# EAGLE design placa (EAGLE 9.5.1)
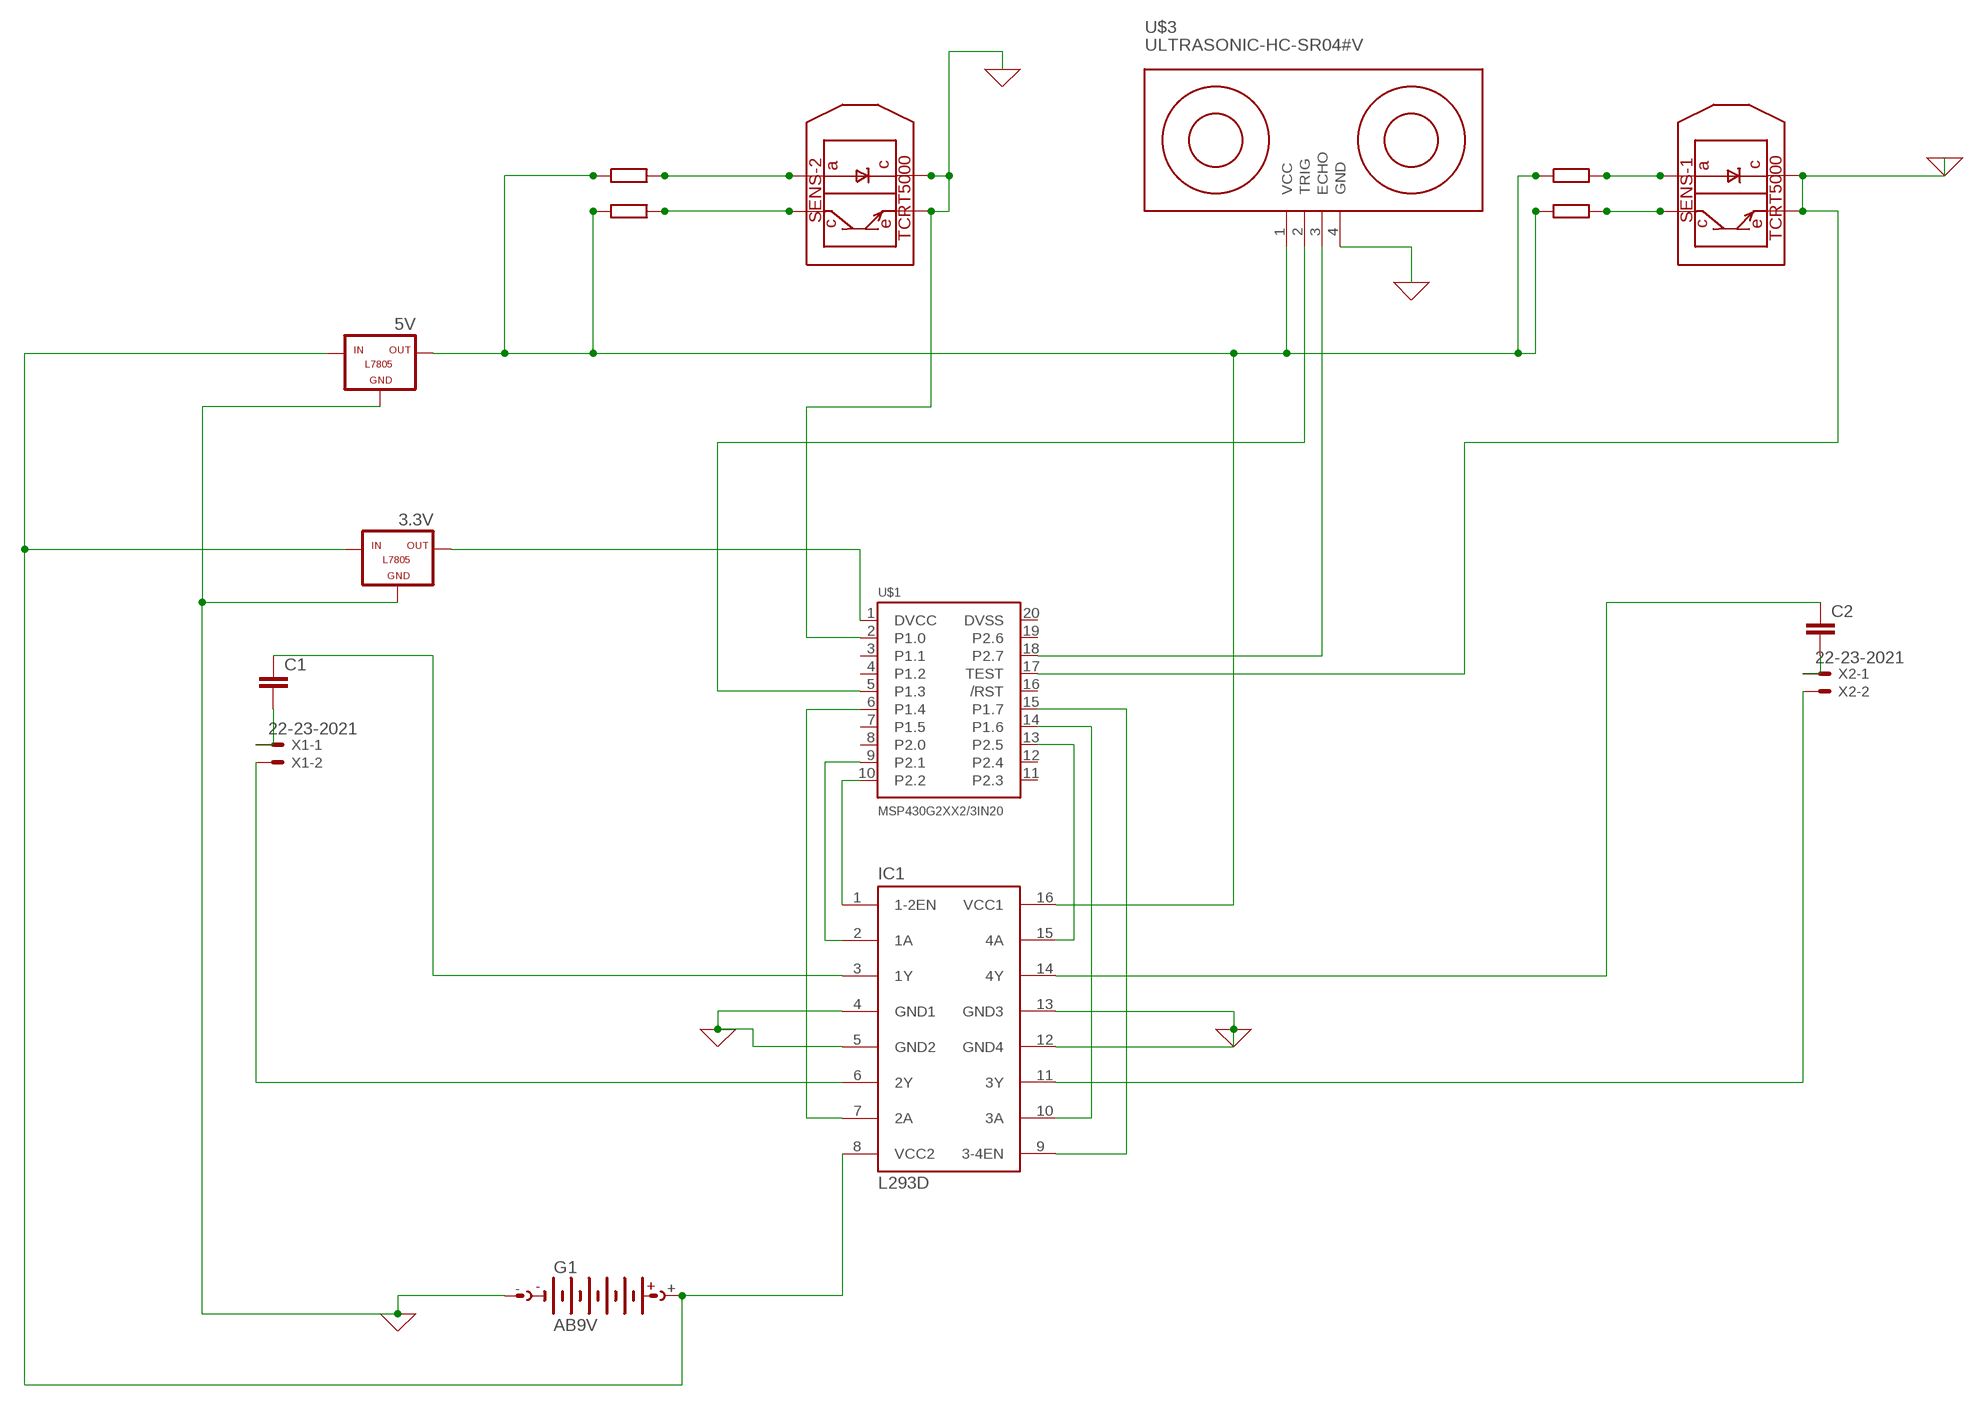
[diagram p0: schematic, sheet 1]

## Parts
3.3V  -L7805  [L7805]
5V  -L7805  [L7805]
C1  C2.5/2  [C2.5-2]
C2  C2.5/2  [C2.5-2]
G1  AB9V  [AB9V]
IC1  L293D  [DIL16]
SENS-1  TCRT5000  [5000]
SENS-2  TCRT5000  [5000]
U$1  MSP430G2XX2/3IN20  [DIL20]
U$3  ULTRASONIC-HC-SR04#V  [ULTRASONIC-HC-SR04#V]
X1  22-23-2021  [22-23-2021]
X2  22-23-2021  [22-23-2021]

## Nets
0: 3.3V.GND 5V.GND G1.- IC1.4(GND1) IC1.5(GND2) IC1.12(GND4) IC1.13(GND3) SENS-1.P$2 SENS-1.P$4 SENS-2.P$2 SENS-2.P$4 U$1.2(P1.0) U$1.17(TEST) U$3.4(GND) ; supply symbol labelled GND
N$1: 3.3V.OUT U$1.1(DVCC)
N$2: SENS-2.P$3
N$3: IC1.1(1-2EN) U$1.10(P2.2)
N$4: IC1.2(1A) U$1.9(P2.1)
N$5: IC1.7(2A) U$1.6(P1.4)
N$6: C1.1 IC1.3(1Y)
N$7: C1.2 X1.1
N$8: IC1.15(4A) U$1.13(P2.5)
N$9: IC1.10(3A) U$1.14(P1.6)
N$10: IC1.9(3-4EN) U$1.15(P1.7)
N$11: IC1.11(3Y) X2.2
N$13: IC1.6(2Y) X1.2
N$14: C2.2 X2.1
N$15: C2.1 IC1.14(4Y)
N$16: 5V.OUT IC1.16(VCC1) U$3.1(VCC)
N$17: SENS-2.P$1
N$18: 3.3V.IN 5V.IN G1.+ IC1.8(VCC2)
N$19: SENS-1.P$3
N$20: SENS-1.P$1
N$22: U$1.5(P1.3) U$3.2(TRIG)
N$23: U$1.18(P2.7) U$3.3(ECHO)
Unconnected: U$1.3(P1.1) U$1.4(P1.2) U$1.7(P1.5) U$1.8(P2.0) U$1.11(P2.3) U$1.12(P2.4) U$1.16(/RST) U$1.19(P2.6)

## Power pins joined to a net without a drawn wire
DVSS: U$1.20(DVSS)

## Library data of the parts
3.3V 5V = tango:-L7805
C1 C2 = capacitor-wima:C: CAPACITOR naming: grid - package width
G1 = battery:AB9V: 9-V BATTERY CLIP
IC1 = st-microelectronics:L293D: PUSH-PULL 4 CHANNEL DRIVER; MPN: L293D; OC_FARNELL: 9589619; OC_NEWARK: 56P8249
SENS-1 SENS-2 = qfm-trx1-24g:TCRT5000: Reflective Optical Sensor with Transistor Output. Vishay Semiconductors
U$1 = ti_msp430gxxx:MSP430G2XX2/3: Mixed Signal Microcontroller MSP430 Value Line MSP430G2432: 1x EEM, 8 KiB Flash Memory, 256 B RAM, 1x Timer_A, 1x USI, 8x ADC10 Ch, 16x I/O MSP430G2332: 1x EEM, 4 KiB Flash Memory, 256 B RAM, 1x Timer_A, 1x USI, 8x ADC10 Ch, 16x I/O MSP430G2232: 1x EEM, 2 KiB Flash Memory, 256 B RAM, 1x Timer_A, 1x USI, 8x ADC10 Ch, 16x I/O MSP430G2132: 1x EEM, 1 KiB Flash Memory, 128 B RAM, 1x Timer_A, 1x USI, 8x ADC10 Ch, 16x I/O MSP430G2402: 1x EEM, 8 KiB Flash Memory, 256 B RAM, 1x Timer_A, 1x USI, 16x I/O MSP430G2302: 1x EEM, 4 KiB Flash Memory, 256 B RAM, 1x Timer_A, 1x USI, 16x I/O MSP430G2202: 1x EEM, 2 KiB Flash Memory, 256 B RAM, 1x Timer_A, 1x USI, 16x I/O MSP430G2102: 1x EEM, 1 KiB Flash Memory, 128 B RAM, 1x Timer_A, 1x USI, 16x I/O MSP430G2452: 1x EEM, 8 KiB Flash Memory, 256 B RAM, 1x Timer_A, 8x Comp_A Ch, 1x USI, 8x ADC10 Ch, 16x I/O MSP430G2352: 1x EEM, 4 KiB Flash Memory, 256 B RAM, 1x Timer_A, 8x Comp_A Ch, 1x USI, 8x ADC10 Ch, 16x I/O MSP430G2252: 1x EEM, 2 KiB Flash Memory, 256 B RAM, 1x Timer_A, 8x Comp_A Ch, 1x USI, 8x ADC10 Ch, 16x I/O MSP430G2152: 1x EEM, 1 KiB Flash Memory, 128 B RAM, 1x Timer_A, 8x Comp_A Ch, 1x USI, 8x ADC10 Ch, 16x I/O MSP430G2412: 1x EEM, 8 KiB Flash Memory, 256 B RAM, 1x Timer_A, 8x Comp_A Ch, 1x USI, 16x I/O MSP430G2312: 1x EEM, 4 KiB Flash Memory, 256 B RAM, 1x Timer_A, 8x Comp_A Ch, 1x USI, 16x I/O MSP430G2212: 1x EEM, 2 KiB Flash Memory, 256 B RAM, 1x Timer_A, 8x Comp_A Ch, 1x USI, 16x I/O MSP430G2112: 1x EEM, 1 KiB Flash Memory, 128 B RAM, 1x Timer_A, 8x Comp_A Ch, 1x USI, 16x I/O MSP430G2533: 1x BSL, 1x EEM, 16 KiB Flash Memory, 512 B RAM, 2x Timer_A, 8x ADC10 Ch, 1x USCI A0/B0, 16x I/O MSP430G2433: 1x BSL, 1x EEM, 8 KiB Flash Memory, 512 B RAM, 2x Timer_A, 8x ADC10 Ch, 1x USCI A0/B0, 16x I/O MSP430G2333: 1x BSL, 1x EEM, 4 KiB Flash Memory, 256 B RAM, 2x Timer_A, 8x ADC10 Ch, 1x USCI A0/B0, 16x I/O MSP430G2233: 1x BSL, 1x EEM, 2 KiB Flash Memory, 256 B RAM, 2x Timer_A, 8x ADC10 Ch, 1x USCI A0/B0, 16x I/O MSP430G2403: 1x BSL, 1x EEM, 8 KiB Flash Memory, 512 B RAM, 2x Timer_A, 1x USCI A0/B0, 16x I/O MSP430G2303: 1x BSL, 1x EEM, 4 KiB Flash Memory, 256 B RAM, 2x Timer_A, 1x USCI A0/B0, 16x I/O MSP430G2203: 1x BSL, 1x EEM, 2 KiB Flash Memory, 256 B RAM, 2x Timer_A, 1x USCI A0/B0, 16x I/O MSP430G2553: 1x BSL, 1x EEM, 16 KiB Flash Memory, 512 B RAM, 2x Timer_A, 8x Comp_A+ Ch, 8x ADC10 Ch, 1x USCI A0/B0, 16x I/O MSP430G2453: 1x BSL, 1x EEM, 8 KiB Flash Memory, 512 B RAM, 2x Timer_A, 8x Comp_A+ Ch, 8x ADC10 Ch, 1x USCI A0/B0, 16x I/O MSP430G2353: 1x BSL, 1x EEM, 4 KiB Flash Memory, 256 B RAM, 2x Timer_A, 8x Comp_A+ Ch, 8x ADC10 Ch, 1x USCI A0/B0, 16x I/O MSP430G2253: 1x BSL, 1x EEM, 2 KiB Flash Memory, 256 B RAM, 2x Timer_A, 8x Comp_A+ Ch, 8x ADC10 Ch, 1x USCI A0/B0, 16x I/O MSP430G2153: 1x BSL, 1x EEM, 1 KiB Flash Memory, 256 B RAM, 2x Timer_A, 8x Comp_A+ Ch, 8x ADC10 Ch, 1x USCI A0/B0, 16x I/O MSP430G2513: 1x BSL, 1x EEM, 16 KiB Flash Memory, 512 B RAM, 2x Timer_A, 8x Comp_A+ Ch, 1x USCI A0/B0, 16x I/O MSP430G2413: 1x BSL, 1x EEM, 8 KiB Flash Memory, 512 B RAM, 2x Timer_A, 8x Comp_A+ Ch, 1x USCI A0/B0, 16x I/O MSP430G2313: 1x BSL, 1x EEM, 4 KiB Flash Memory, 256 B RAM, 2x Timer_A, 8x Comp_A+ Ch, 1x USCI A0/B0, 16x I/O MSP430G2213: 1x BSL, 1x EEM, 2 KiB Flash Memory, 256 B RAM, 2x Timer_A, 8x Comp_A+ Ch, 1x USCI A0/B0, 16x I/O MSP430G2113: 1x BSL, 1x EEM, 1 KiB Flash Memory, 256 B RAM, 2x Timer_A, 8x Comp_A+ Ch, 1x USCI A0/B0, 16x I/O
U$3 = diy-modules:ULTRASONIC-HC-SR04: Ultrasonic Ranging Module HC-SR04 More details available here: http://randomnerdtutorials.com/complete-guide-for-ultrasonic-sensor-hc-sr04/ Click here to find device on ebay.com <http://www.ebay.com/sch/hc+sr04+ultrasonic>
X1 X2 = con-molex:22-23-2021: .100" (2.54mm) Center Header - 2 Pin; MF: MOLEX; MPN: 22-23-2021; OC_FARNELL: 1462926; OC_NEWARK: 25C3832

## Board
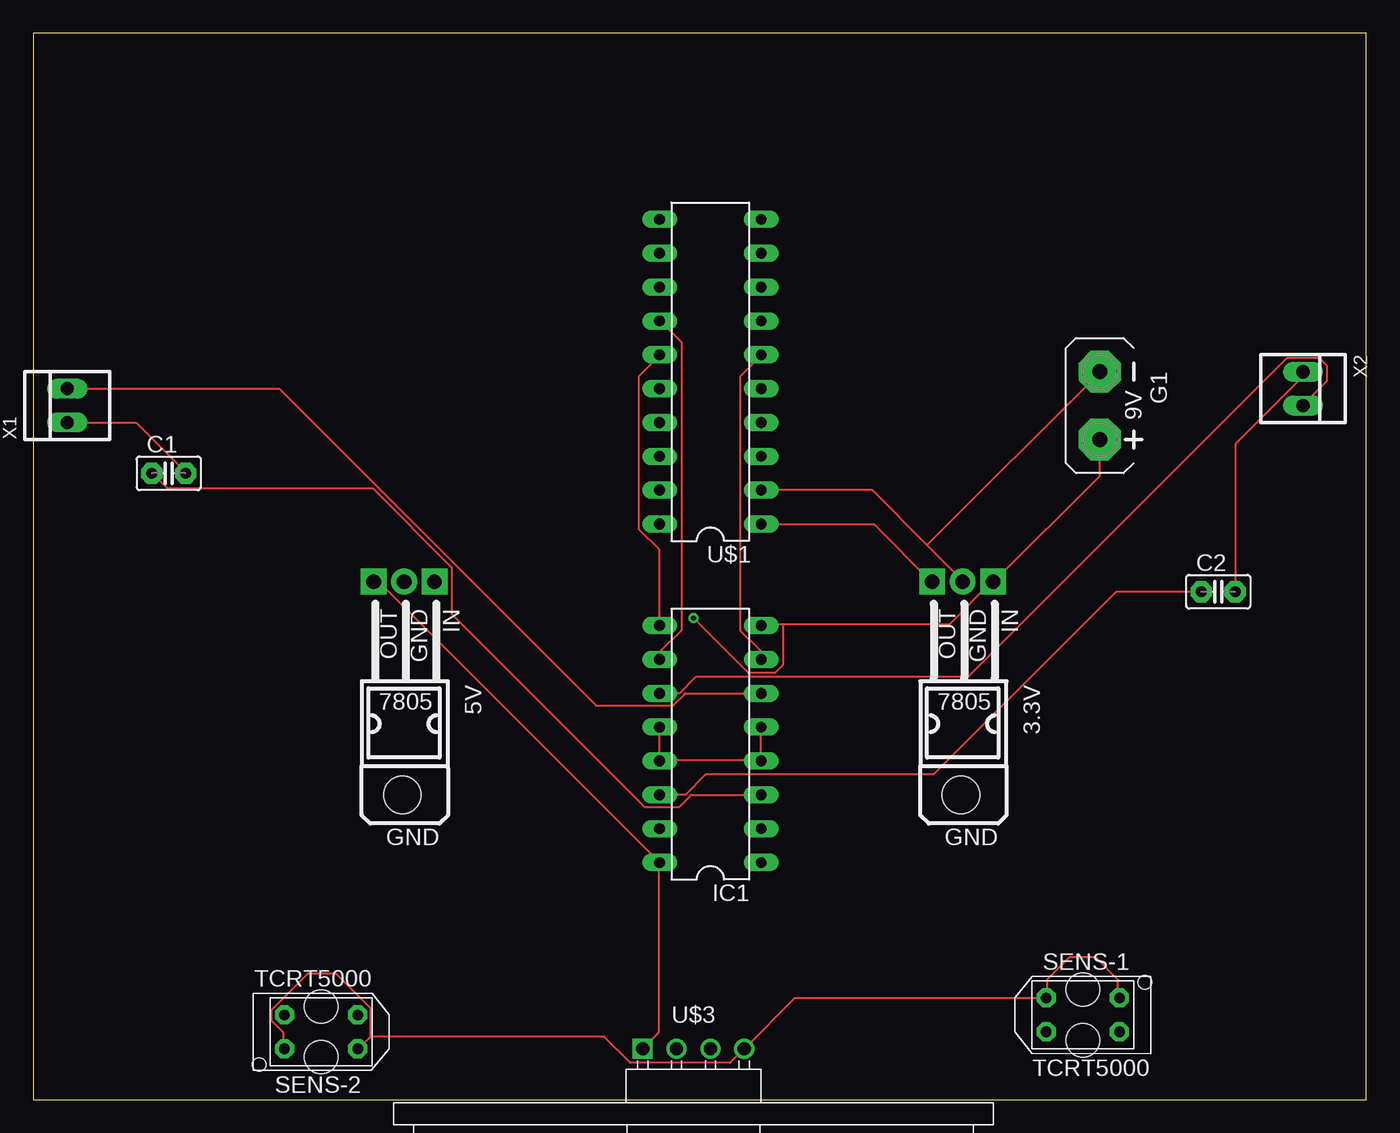
[diagram p1: board, top side]
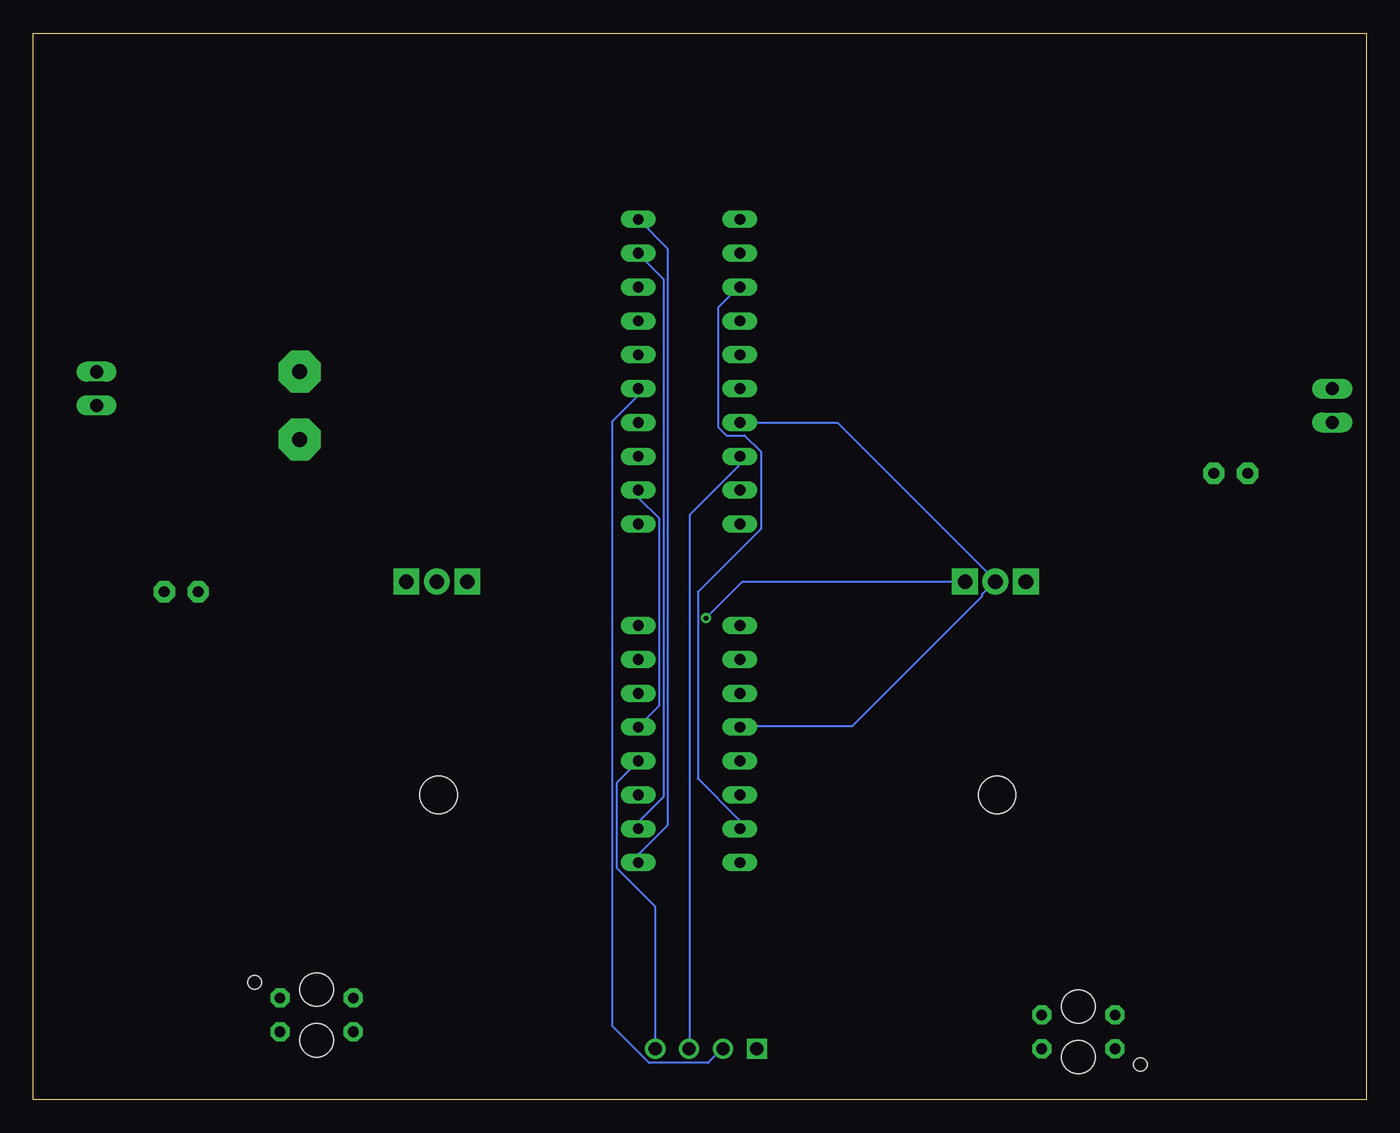
[diagram p2: board, bottom side, seen from below]

Size 100 x 80 mm. Coordinates in mm from the lower left corner, seen from the top.
Outline: 0,0 100,0 100,80 0,80 0,0
Copper layers (1*16): Top 0.035mm / dielectric 1.5mm / Bottom 0.035mm
Design rules "default": minimum track width 6mil, minimum drill 0.35mm, track to track 6mil, track to pad 6mil, pad to pad 6mil, via to via 6mil, smd to smd 6mil, copper to edge 40mil, drill to drill 6mil, minimum pad ring 10mil, minimum via ring 8mil, stop-mask expansion 4mil, vias tented up to drill 0mil, thermal gap 10mil

### Footprints (pad centres in the part's own frame; a part is rotated, then mirrored left to right if it is on the bottom)
L7805 = drill 1.1 pad 1.93: GND 0.127,-9.652 | drill 1.1 pad 1.93 square: IN -2.159,-9.652; OUT 2.413,-9.652 | hole 2.8: 0.254,6.35
C2.5-2 = drill 0.813 pad 1.6 octagon: 1 -1.27,0; 2 1.27,0
AB9V = drill 1.118 pad 3.15 octagon: + 0,2.54; - 0,-2.54
DIL16 = drill 0.813 long: 1 -8.89,-3.81; 2 -6.35,-3.81; 3 -3.81,-3.81; 4 -1.27,-3.81; 5 1.27,-3.81; 6 3.81,-3.81; 7 6.35,-3.81; 8 8.89,-3.81; 9 8.89,3.81; 10 6.35,3.81; 11 3.81,3.81; 12 1.27,3.81; 13 -1.27,3.81; 14 -3.81,3.81; 15 -6.35,3.81; 16 -8.89,3.81
5000 = drill 0.8 pad 1.422 octagon: P$1 -2.75,1.27; P$2 -2.75,-1.27; P$3 2.75,1.27; P$4 2.75,-1.27 | hole 2.5: 0,1.9; 0,-1.9 | hole 1: -4.65,-2.45
DIL20 = drill 0.813 long: 1 -11.43,-3.81; 2 -8.89,-3.81; 3 -6.35,-3.81; 4 -3.81,-3.81; 5 -1.27,-3.81; 6 1.27,-3.81; 7 3.81,-3.81; 8 6.35,-3.81; 9 8.89,-3.81; 10 11.43,-3.81; 11 11.43,3.81; 12 8.89,3.81; 13 6.35,3.81; 14 3.81,3.81; 15 1.27,3.81; 16 -1.27,3.81; 17 -3.81,3.81; 18 -6.35,3.81; 19 -8.89,3.81; 20 -11.43,3.81
ULTRASONIC-HC-SR04#V = drill 1 square: 1 -3.81,0 | drill 1: 2 -1.27,0; 3 1.27,0; 4 3.81,0
22-23-2021 = drill 1 long: 1 -1.27,0; 2 1.27,0

### Placement (x,y rotation side)
3.3V  69.85,29.21 180 top
5V  27.94,29.21 180 top
C1  10.16,46.99 0 top
C2  88.9,38.1 0 top
G1  80.01,52.07 180 top
IC1  50.8,26.67 90 top
SENS-1  78.74,6.35 180 top
SENS-2  21.59,5.08 0 top
U$1  50.8,54.61 90 top
U$3  49.53,3.81 0 top
X1  2.54,52.07 90 top
X2  95.25,53.34 270 top

### Tracks (layer width: path | path; a pad name or v marks a point on that pad's centre or on a via)
0
  Top 0.152: U$1.2 62.94,45.72 67.06,41.6 | 67.06,41.6 69.8,38.86 3.3V.GND | 67.06,41.6 80.01,54.56 G1.- | 25.3,4.72 25.3,6.86 22.71,9.45 20.57,9.45 17.83,6.71 17.83,5.94 18.75,5.03 18.75,3.81 SENS-2.P$2 | 25.3,4.72 24.38,3.81 SENS-2.P$4 | SENS-1.P$2 81.38,7.62 81.38,8.99 79.7,10.67 77.72,10.67 76.05,8.99 76.05,7.62 SENS-1.P$4 57.15,7.62 U$3.4 52.27,2.74 44.81,2.74 42.82,4.72 25.3,4.72 | IC1.12 46.94,27.89 46.94,25.45 IC1.13 47.09,25.45 54.56,25.45 | 54.56,25.45 54.56,27.89 IC1.5 | 54.56,25.45 IC1.4
  Bottom 0.152: U$1.17 46.94,50.75 39.62,50.75 27.74,38.86 5V.GND 27.89,38.86 28.8,37.95 28.8,37.8 38.56,28.04 46.94,28.04 IC1.12 | U$3.4 53.34,14.48 56.24,17.37 56.24,23.77 IC1.4 | U$1.2 54.56,45.72 54.56,45.11 53.03,43.59 53.03,29.57 54.56,28.04 IC1.5
N$1
  Top 0.152: U$1.1 54.71,43.13 63.09,43.13 67.36,38.86 3.3V.OUT
N$3
  Bottom 0.152: U$1.10 52.43,63.86 52.43,20.57 54.56,18.44 54.56,17.83 IC1.1
N$4
  Bottom 0.152: IC1.2 54.56,20.42 54.56,20.88 52.73,22.71 52.73,61.57 54.56,63.4 U$1.9
N$5
  Top 0.152: IC1.7 54.56,33.07 54.56,33.68 53.03,35.2 53.03,54.25 54.56,55.78 U$1.6
N$6
  Top 0.152: IC1.3 49.38,22.86 48.46,21.95 45.87,21.95 31.39,36.42 31.39,39.93 25.45,45.87 10.06,45.87 8.99,46.94 C1.1
N$7
  Top 0.152: X1.1 2.59,50.75 7.77,50.75 11.43,47.09 C1.2
N$8
  Bottom 0.152: IC1.15 47.09,20.42 47.09,21.03 50.14,24.08 50.14,38.1 45.41,42.82 45.41,48.62 46.63,49.84 48.01,49.84 48.62,50.44 48.62,59.44 47.09,60.96 U$1.13
N$9
  Top 0.152: IC1.10 47.09,33.07 47.09,33.68 48.62,35.2 48.62,56.84 47.09,58.37 U$1.14
N$10
  Top 0.152: IC1.9 46.94,35.66 46.94,41.3 45.41,42.82 45.41,54.25 46.94,55.78 U$1.15
N$11
  Top 0.152: IC1.11 48.46,30.48 49.68,31.7 70.1,31.7 94.03,55.63 96.47,55.63 97.08,55.02 97.08,53.95 95.25,52.12 X2.2
N$13
  Top 0.152: IC1.6 48.92,30.48 48.01,29.57 42.22,29.57 18.44,53.34 X1.2
N$14
  Top 0.152: X2.1 95.25,54.25 90.22,49.23 90.22,38.1 C2.2
N$15
  Top 0.152: IC1.14 48.92,22.86 50.44,24.38 67.51,24.38 81.23,38.1 C2.1
N$16
  Top 0.152: U$3.1 46.94,5.03 46.94,17.68 IC1.16 25.91,38.86 5V.OUT
N$18  (via drill 0.35)
  Top 0.152: 56.24,35.66 68.73,35.66 71.93,38.86 3.3V.IN 72.08,38.86 80.01,46.79 G1.+ | 56.24,35.66 54.71,35.66 IC1.8 | v49.53,36.12 53.65,32 55.63,32 56.24,32.61 56.24,35.66
  Bottom 0.152: 5V.IN 46.79,38.86 v49.53,36.12
N$22
  Bottom 0.152: U$1.5 54.71,53.34 54.71,52.73 56.54,50.9 56.54,5.49 53.8,2.74 49.38,2.74 48.31,3.81 U$3.2
N$23
  Bottom 0.152: U$1.18 47.09,48.16 47.09,47.55 50.75,43.89 50.75,3.81 U$3.3